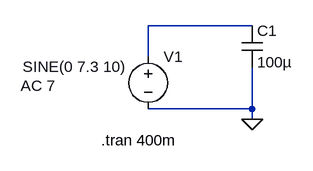
[diagram p0: schematic Lab2_cond.asc]
Lab2_cond.asc, the LTspice schematic file:
Version 4
SHEET 1 880 680
WIRE 224 32 64 32
WIRE 64 80 64 32
WIRE 224 160 224 96
WIRE 224 160 64 160
WIRE 224 176 224 160
FLAG 224 176 0
SYMBOL cap 208 32 R0
SYMATTR InstName C1
SYMATTR Value 100µ
SYMBOL voltage 64 64 R0
WINDOW 123 -196 60 Left 2
WINDOW 39 0 0 Left 0
WINDOW 3 -193 31 Left 2
SYMATTR Value2 AC 7
SYMATTR Value SINE(0 7.3 10)
SYMATTR InstName V1
TEXT -8 208 Left 2 !.tran 400m

The netlist it stands for:
* Lab2_cond.asc
C1 N001 0 100µ
V1 N001 0 SINE(0 7.3 10) AC 7
.tran 400m
.backanno
.end